# Altium schematic sheet de23.SchDoc
size A4; SheetNumber: 1; SheetTotal: 1; SPICEModelCacheEHRSGNDD: <root> / <DocumentId>EHRSGNDD</DocumentId> / <CacheFrame Number="0"> / <Model Name="led0" Kind="MDL"> / <Text>*Typ INFRARED GaAs LED: Vf=1.2V Vr=5V If=40mA trr=3uS / *LED Pinout: 1=A, 2=K / .MODEL LED0 D (IS=93.5P RS=84M N=2.63 BV=5 IBV=10U / + CJO=2.97P VJ=.75 M=.333 TT=4.32U)</Text> / </Model> / <Model Name="nmos" Kind="MDL"> / <Text>*Default N-Channel MOSFET / *Pinout: D,G,S / .MODEL NMOS NMOS()</Text> / </Model> / <Model Name="1n4007" Kind="MDL"> / <Text>*1N4007 MCE 8-16-95 / *1000V 1A Si GenPurpose Diode pkg:DIODE0.4 1,2 / .MODEL 1N4007 D(IS=2.55E-9 RS=0.042 N=1.75 TT=5.76E-6 CJO=1.85E-11 / + VJ=0.75 M=0.333 BV=1000 IBV=9.86E-5 )</Text> / </Model> / </CacheFrame> / </root>
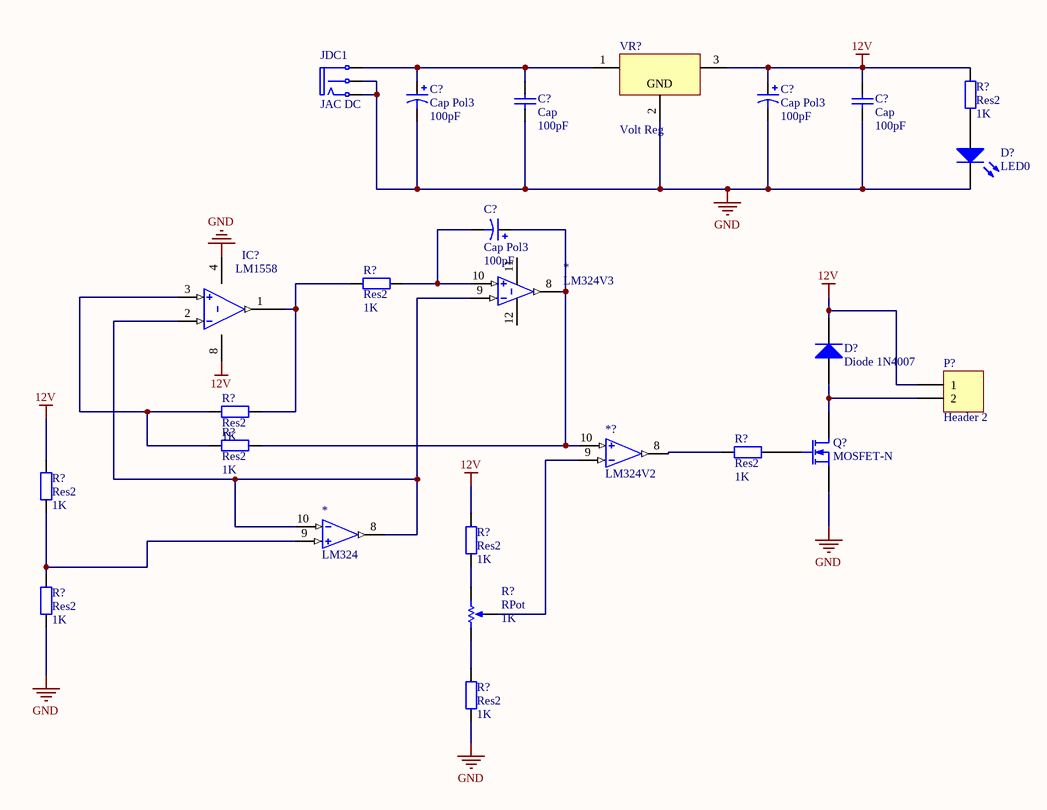
[diagram p0: de23.SchDoc]

## Parts
(Parts that share a designator on the sheet are numbered #1, #2 ... from top to bottom, then left to right.)
*#1  LM324V3
*#2  LM324
*?  LM324V2
C?#1  Cap Pol3  value 100pF  [C0805]
C?#2  Cap Pol3  value 100pF  [C0805]
C?#3  Cap  value 100pF  [RAD-0.3]
C?#4  Cap  value 100pF  [RAD-0.3]
C?#5  Cap Pol3  value 100pF  [C0805]
D?#1  LED0  [LED-0]
D?#2  Diode 1N4007  [DO-41]
IC?  LM1558
JDC1  JAC DC
P?  Header 2  [HDR1X2]
Q?  MOSFET-N  [E3]
R?#1  Res2  value 1K  [AXIAL-0.4]
R?#2  Res2  value 1K  [AXIAL-0.4]
R?#3  Res2  value 1K  [AXIAL-0.4]
R?#4  Res2  value 1K  [AXIAL-0.4]
R?#5  Res2  value 1K  [AXIAL-0.4]
R?#6  Res2  value 1K  [AXIAL-0.4]
R?#7  Res2  value 1K  [AXIAL-0.4]
R?#8  Res2  value 1K  [AXIAL-0.4]
R?#9  RPot  value 1K  [VR5]
R?#10  Res2  value 1K  [AXIAL-0.4]
VR?  Volt Reg  [D2PAK_N]

## Nets
12V: C?#2.1 C?#4.2 D?#2.2(K) IC?.8 P?.1 R?#1.2 R?#6.2 R?#7.2 VR?.3(Vout)
GND: C?#1.2 C?#2.2 C?#3.1 C?#4.1 D?#1.2(K) IC?.4 JDC1.2 JDC1.3 Q?.3(S) R?#8.1 R?#10.1 VR?.2(GND)
Net*#1_8: *#1.8 *?.10 C?#5.1 R?#4.2
Net*#1_9: *#1.9 *#2.8 *#2.10 IC?.2
Net*#1_10: *#1.10 C?#5.2 R?#2.2
Net*#2_9: *#2.9 R?#6.1 R?#8.2
Net*?_8: *?.8 R?#5.1
Net*?_9: *?.9 R?#9.3(TAP)
NetC?#1_1: C?#1.1 C?#3.2 JDC1.1 VR?.1(Vin)
NetD?#1_1: D?#1.1(A) R?#1.1
NetD?#2_1: D?#2.1(A) P?.2 Q?.1(D)
NetIC?_1: IC?.1 R?#2.1 R?#3.2
NetIC?_3: IC?.3 R?#3.1 R?#4.1
NetQ?_2: Q?.2(G) R?#5.2
NetR?#7_1: R?#7.1 R?#9.2(BOT)
NetR?#9_1: R?#9.1(TOP) R?#10.2

Not connected (* = marked no-connect by the designer): *#1 11 12

## Library data of the parts
C?#1 C?#2 C?#5 = Cap Pol3: Polarized Capacitor (Surface Mount); Published: 8-Jun-2000; LatestRevisionDate: 29-May-2009; LatestRevisionNote: IPC-7351 Footprint Added.; PackageReference: C0805; Publisher: Altium Limited; PackageDescription: Chip Capacitor
C?#3 C?#4 = Cap: Capacitor; Published: 8-Jun-2000; LatestRevisionDate: 17-Jul-2002; LatestRevisionNote: Re-released for DXP Platform.; PackageReference: RAD-0.3; Publisher: Altium Limited; PackageDescription: Radial Cap, Thru-Hole; 2 Leads; 0.3 in Pin Spacing
D?#1 = LED0: Typical INFRARED GaAs LED; Published: 8-Jun-2000; LatestRevisionDate: 08-Jul-2005; LatestRevisionNote: Mech Layer 1 removed.; PackageReference: LED-0; Publisher: Altium Limited; PackageDescription: LED; 2 Leads
D?#2 = Diode 1N4007: 1 Amp General Purpose Rectifier; Published: 8-Jun-2000; LatestRevisionDate: 17-Jul-2002; LatestRevisionNote: Re-released for DXP Platform.; DatasheetVersion: 1998; PackageVersion: Aug-1999; PackageReference: DO-41; Publisher: Altium Limited; PackageDescription: Diode, Axial; Body 5.2 x 2.7 mm (LxDia. max), Lead Dia. 0.86 mm (max); Code_JEDEC: DO-204-AL; ComponentLink1Description: Manufacturer Link; ComponentLink1URL: http://www.fairchildsemi.com/; ComponentLink2Description: Datasheet; ComponentLink2URL: http://www.fairchildsemi.com/ds/1N%2F1N4001.pdf
P? = Header 2: Header, 2-Pin; LatestRevisionDate: 17-Jul-2002; LatestRevisionNote: Re-released for DXP Platform.; Publisher: Altium Limited
Q? = MOSFET-N: N-Channel MOSFET; Published: 8-Jun-2000; LatestRevisionDate: 17-Jul-2002; LatestRevisionNote: Re-released for DXP Platform.; PackageVersion: 1995/1996; PackageReference: E3; Publisher: Altium Limited; PackageDescription: TO, Flat Index; 3 In-Line, Axial Leads; Body Dia. 4.6mm; Lead Dia. 0.5 mm (max)
R?#1-R?#8 R?#10 = Res2: Resistor; Published: 8-Jun-2000; LatestRevisionDate: 17-Jul-2002; LatestRevisionNote: Re-released for DXP Platform.; PackageReference: AXIAL-0.4; Publisher: Altium Limited; PackageDescription: Axial Device, Thru-Hole; 2 Leads; 0.4 in Pin Spacing
R?#9 = RPot: Potentiometer; Sim Note: Enter the Resistance value and the set point into parameter fields.; Set Position: 0.5; Published: 8-Jun-2000; LatestRevisionDate: 17-Jul-2002; LatestRevisionNote: Re-released for DXP Platform.; PackageReference: VR5; Publisher: Altium Limited; PackageDescription: Variable Resistor, Thru-Hole; 3 Leads
VR? = Volt Reg: Voltage Regulator; Published: 24-Mar-1999; LatestRevisionDate: 29-May-2009; LatestRevisionNote: IPC-7351 Footprint Added.; PackageReference: D2PAK; Publisher: Altium Limited; PackageDescription: 3-Pin Transistor Outline Package 2.54 mm Pitch, 15.1 mm Lead Span